# EAGLE schematic lpc_connections (EAGLE 7.3.0)
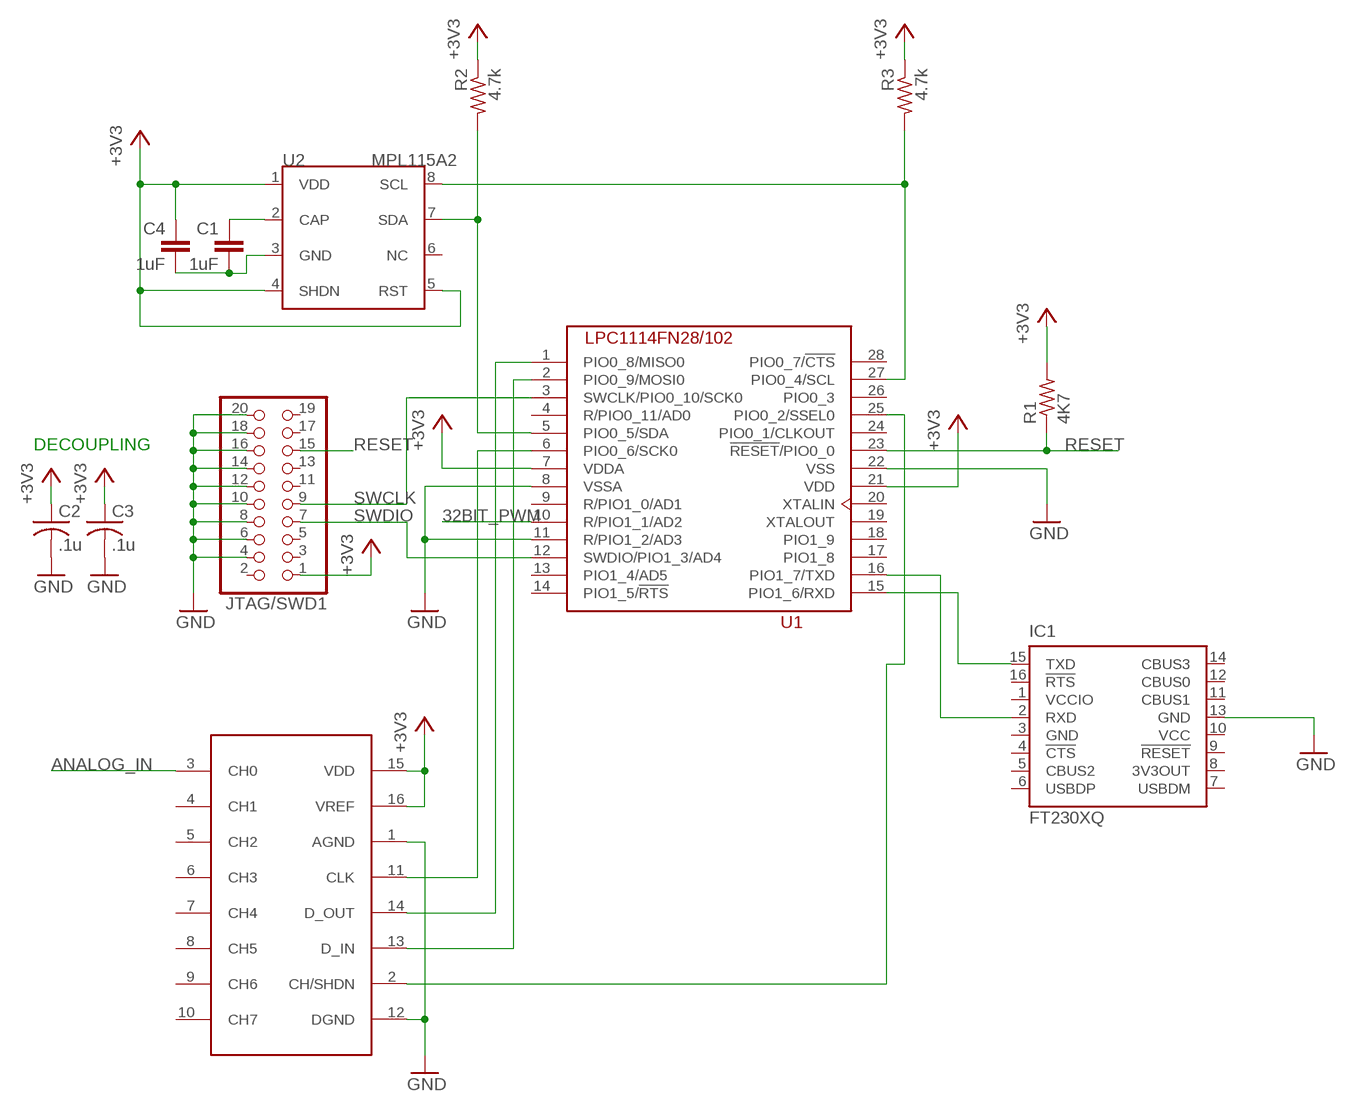
[diagram p0: schematic, sheet 1]

## Parts
C1  1uF  C2,5-3  [C2.5-3]
C2  .1u  C-US050-024X044  [C050-024X044]
C3  .1u  C-US050-024X044  [C050-024X044]
C4  1uF  C2,5-3  [C2.5-3]
IC1  FT230XQ  [QFN16]
JTAG/SWD1  PINHD-2X10  [2X10]
R1  4K7  R-US_0207/10  [0207/10]
R2  4.7k  R-US_0204/5  [0204/5]
R3  4.7k  R-US_0204/5  [0204/5]
U1  LPC1114FN28/102  [DIL28-6]
U2  MPL115A2  [LGA-8]
U$1  MCP3008  [MCP3008]

## Nets
32BIT_PWM: U1.10(R/PIO1_1/AD2)
+3V3: C2.1 C3.1 C4.1 JTAG/SWD1.1 R1.2 R2.1 R3.1 U1.7(VDDA) U1.21(VDD) U2.1(VDD) U2.4(SHDN) U2.5(RST) U$1.15(VDD) U$1.16(VREF)
ANALOG_IN: U$1.3(CH0)
GND: C2.2 C3.2 IC1.13(GND) JTAG/SWD1.4 JTAG/SWD1.6 JTAG/SWD1.8 JTAG/SWD1.10 JTAG/SWD1.12 JTAG/SWD1.14 JTAG/SWD1.16 JTAG/SWD1.18 JTAG/SWD1.20 U1.8(VSSA) U1.11(R/PIO1_2/AD3) U1.22(VSS) U$1.1(AGND) U$1.12(DGND)
N$1: IC1.15(TXD) U1.15(PIO1_6/RXD)
N$2: IC1.2(RXD) U1.16(PIO1_7/TXD)
N$3: R2.2 U1.5(PIO0_5/SDA) U2.7(SDA)
N$4: R3.2 U1.27(PIO0_4/SCL) U2.8(SCL)
N$5: C1.1 U2.2(CAP)
N$6: C1.2 C4.2 U2.3(GND)
N$9: U1.25(PIO0_2/SSEL0) U$1.2(CH/SHDN)
N$10: U1.2(PIO0_9/MOSI0) U$1.13(D_IN)
N$11: U1.1(PIO0_8/MISO0) U$1.14(D_OUT)
N$12: U1.6(PIO0_6/SCK0) U$1.11(CLK)
RESET: JTAG/SWD1.15 R1.1 U1.23(!RESET!/PIO0_0)
SWCLK: JTAG/SWD1.9 U1.3(SWCLK/PIO0_10/SCK0)
SWDIO: JTAG/SWD1.7 U1.12(SWDIO/PIO1_3/AD4)
Unconnected: IC1.4(!CTS) IC1.5(CBUS2) IC1.6(USBDP) IC1.7(USBDM) IC1.8(3V3OUT) IC1.9(!RESET) IC1.11(CBUS1) IC1.12(CBUS0) IC1.14(CBUS3) IC1.16(!RTS) JTAG/SWD1.2 JTAG/SWD1.3 JTAG/SWD1.5 JTAG/SWD1.11 JTAG/SWD1.13 JTAG/SWD1.17 JTAG/SWD1.19 U1.4(R/PIO0_11/AD0) U1.9(R/PIO1_0/AD1) U1.13(PIO1_4/AD5) U1.14(PIO1_5/!RTS) U1.17(PIO1_8) U1.18(PIO1_9) U1.19(XTALOUT) U1.20(XTALIN) U1.24(PIO0_1/CLKOUT) U1.26(PIO0_3) U1.28(PIO0_7/!CTS) U2.6(NC) U$1.4(CH1) U$1.5(CH2) U$1.6(CH3) U$1.7(CH4) U$1.8(CH5) U$1.9(CH6) U$1.10(CH7)

## Notes on the sheet
- DECOUPLING

## Power pins joined to a net without a drawn wire
GND: IC1.3(GND)
VCC: IC1.10(VCC)
VCCIO: IC1.1(VCCIO)

## Library data of the parts
C1 C4 = capacitor-wima:C: CAPACITOR naming: grid - package width
C2 C3 = rcl:C-US: CAPACITOR, American symbol
IC1 = ftdichip:FT230X: USB to BASIC UART IC Auto generated by make-symbol-device-package-bsdl.ulp Rev. 43 Source: Data sheet <http://www.ftdichip.com/Support/Documents/DataSheets/ICs/DS_FT230X.pdf>
JTAG/SWD1 = pinhead:PINHD-2X10: PIN HEADER
R1 = rcl:R-US_: RESISTOR, American symbol
R2 R3 = resistor:R-US_: RESISTOR, American symbol
U1 = lpc_11xx:LPC1114FN28/102
U2 = nonolith:MPL115A2: MPL115A2 (I2C) Miniature Digital Barometer 5.0x3.0x1.2mm LGA Package
U$1 = MCP3008:MCP3008